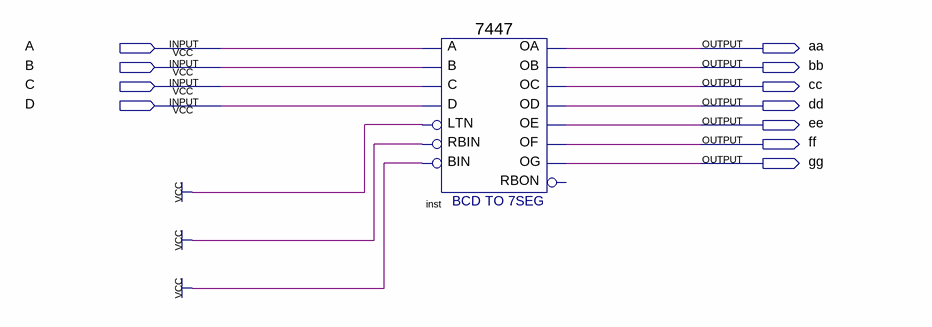
[diagram p0: schematic sheet]
// Quartus schematic seven_seg_decoder_7447.bdf as structural Verilog: 1 symbols, 11 pins
module seven_seg_decoder_7447 (
  input  A,
  input  B,
  input  C,
  input  D,
  output aa,
  output bb,
  output cc,
  output dd,
  output ee,
  output ff,
  output gg
);

  \7447  inst (
    .LTN(1'b1), .B(B), .C(C), .D(D), .RBIN(1'b1), .BIN(1'b1), .A(A), .OB(bb), .OC(cc), .OE(ee), .OD(dd),
    .OF(ff), .OG(gg), .OA(aa));  // open: RBON
endmodule
